# EAGLE design numitron-driver-v001 (EAGLE 9.2.1)
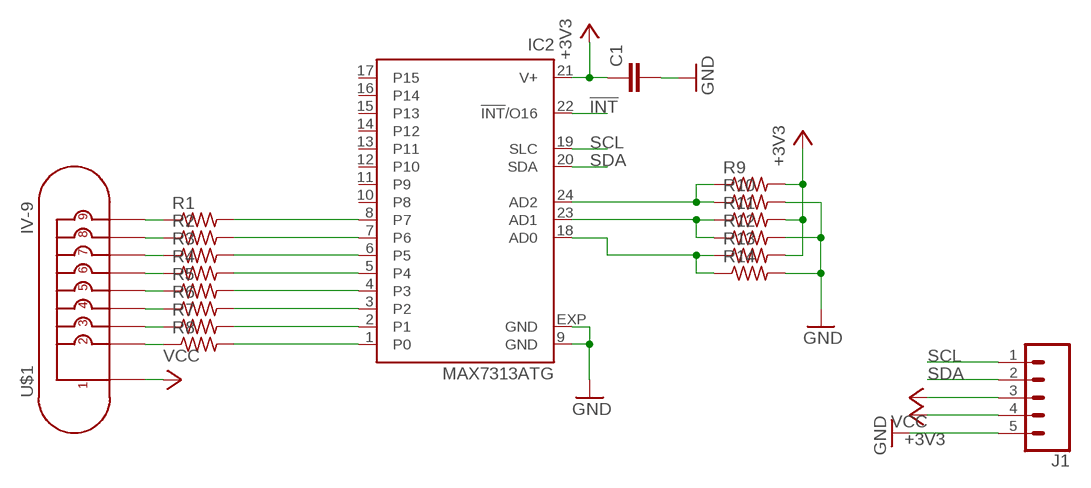
[diagram p0: schematic, sheet 1]

## Parts
C1  C-EUC0603  [C0603]
IC2  MAX7313ATG  [TQFN24-EP]
J1  CONN_05NO_SILK  [1X05_NO_SILK]
R1  R-US_R0603  [R0603]
R2  R-US_R0603  [R0603]
R3  R-US_R0603  [R0603]
R4  R-US_R0603  [R0603]
R5  R-US_R0603  [R0603]
R6  R-US_R0603  [R0603]
R7  R-US_R0603  [R0603]
R8  R-US_R0603  [R0603]
R9  R-US_R0402  [R0402]
R10  R-US_R0402  [R0402]
R11  R-US_R0402  [R0402]
R12  R-US_R0402  [R0402]
R13  R-US_R0402  [R0402]
R14  R-US_R0402  [R0402]
U$1  IV-9  [IV-9]

## Nets
!INT: IC2.22(!INT!/O16)
+3V3: C1.1 IC2.21(V+) J1.4 R9.2 R11.2 R13.2
GND: C1.2 IC2.9(GND) IC2.EXP(GND) J1.5 R10.2 R12.2 R14.2
N$1: R1.1 U$1.9
N$2: R2.1 U$1.8
N$3: R3.1 U$1.7
N$4: R4.1 U$1.6
N$5: R5.1 U$1.5
N$6: R6.1 U$1.4
N$7: R7.1 U$1.3
N$8: R8.1 U$1.2
N$9: IC2.1(P0) R8.2
N$10: IC2.2(P1) R7.2
N$11: IC2.3(P2) R6.2
N$12: IC2.4(P3) R5.2
N$13: IC2.5(P4) R4.2
N$14: IC2.6(P5) R3.2
N$15: IC2.7(P6) R2.2
N$16: IC2.8(P7) R1.2
N$24: IC2.18(AD0) R13.1 R14.1
N$25: IC2.23(AD1) R11.1 R12.1
N$26: IC2.24(AD2) R9.1 R10.1
SCL: IC2.19(SLC) J1.1
SDA: IC2.20(SDA) J1.2
VCC: J1.3 U$1.1
Unconnected: IC2.10(P8) IC2.11(P9) IC2.12(P10) IC2.13(P11) IC2.14(P12) IC2.15(P13) IC2.16(P14) IC2.17(P15)

## Library data of the parts
C1 = rcl:C-EU: CAPACITOR, European symbol; SPICEPREFIX: C
IC2 = maxim:MAX7313ATG: 16-Port I/O Expander with LED Intensity Control, Interrupt, and Hot-Insertion Protection Source: http://datasheets.maxim-ic.com/en/ds/MAX7313.pdf; MF: MAXIM; MPN: MAX7313ATG; OC_FARNELL: unknown; OC_NEWARK: 87H1899
J1 = SparkFun-Connectors:CONN_05: Multi connection point. Often used as Generic Header-pin footprint for 0.1 inch spaced/style header connections On any of the 0.1 inch spaced packages, you can populate with these: Break Away Headers - Straight <https://www.sparkfun.com/products/116> (PRT-00116) Break Away Male Headers - Right Angle <https://www.sparkfun.com/products/553> (PRT-00553) Female Headers <https://www.sparkfun.com/products/115> (PRT-00115) Break Away Headers - Machine Pin <https://www.sparkfun.com/products/117> (PRT-00117) Break Away Female Headers - Swiss Machine Pin <https://www.sparkfun.com/products/743> (PRT-00743) For SCREWTERMINALS and SPRING TERMINALS visit here: Screw Terimnals on SparkFun.com <https://www.sparkfun.com/search/results?term=Screw+Terminals> (5mm/3.5mm/2.54mm spacing) This device is also useful as a general connection point to wire up your design to another part of your project. Our various solder wires solder well into these plated through hole pads. Hook-Up Wire - Assortment (Stranded, 22 AWG) <https://www.sparkfun.com/products/11375> (PRT-11375) Hook-Up Wire - Assortment (Solid Core, 22 AWG) <https://www.sparkfun.com/products/11367> (PRT-11367) View the entire wire category on our website here <https://www.sparkfun.com/categories/141> Special notes: Molex polarized connector foot print use with SKU : PRT-08231 with associated crimp pins and housings. 1MM SMD Version SKU: PRT-10208
R1-R14 = adafruit:R-US_: RESISTOR, American symbol
U$1 = domestichacks:IV-9

## Board
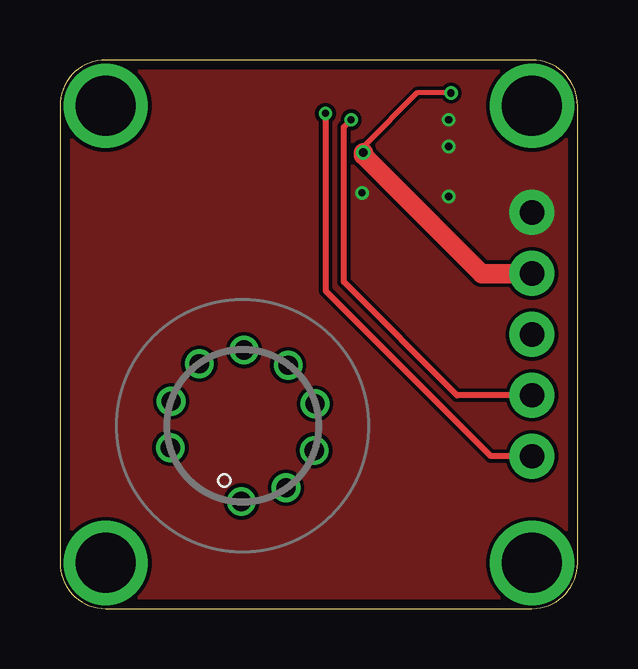
[diagram p1: board, top side]
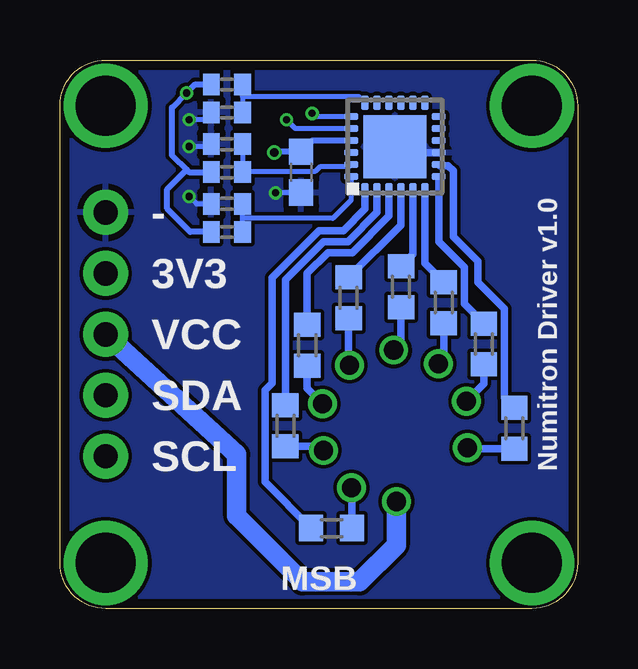
[diagram p2: board, bottom side, seen from below]

Size 21.59 x 22.86 mm. Coordinates in mm from the lower left corner, seen from the top.
Outline: 1.91,0 19.68,0 arc90 21.59,1.91 21.59,20.95 arc90 19.68,22.86 1.91,22.86 arc90 0,20.95 0,1.91 arc90 1.91,0
Copper layers (1*16): Top 0.035559375mm / dielectric 1.6mm / Bottom 0.035559375mm
Design rules "oshpark-2layer *": minimum track width 6mil, minimum drill 10mil, track to track 6mil, track to pad 6mil, pad to pad 6mil, via to via 6mil, smd to smd 6mil, copper to edge 15mil, drill to drill 6mil, minimum pad ring 5mil, minimum via ring 5mil, stop-mask expansion 2.5mil, vias tented up to drill 20mil, thermal gap 10mil

### Footprints (pad centres in the part's own frame; a part is rotated, then mirrored left to right if it is on the bottom)
C0603 = smd 1.1 x 1: 1 -0.85,0; 2 0.85,0
TQFN24-EP = smd 0.6 x 0.3: 1 -1.825,1.25; 2 -1.825,0.75; 3 -1.825,0.25; 4 -1.825,-0.25; 5 -1.825,-0.75; 6 -1.825,-1.25; 13 1.825,-1.25; 14 1.825,-0.75; 15 1.825,-0.25; 16 1.825,0.25; 17 1.825,0.75; 18 1.825,1.25 | smd 0.3 x 0.6: 7 -1.25,-1.825; 8 -0.75,-1.825; 9 -0.25,-1.825; 10 0.25,-1.825; 11 0.75,-1.825; 12 1.25,-1.825; 19 1.25,1.825; 20 0.75,1.825; 21 0.25,1.825; 22 -0.25,1.825; 23 -0.75,1.825; 24 -1.25,1.825 | smd 2.63 x 2.63: EXP 0,0
1X05_NO_SILK = drill 1.016 pad 1.88: 1 0,0; 2 2.54,0; 3 5.08,0; 4 7.62,0; 5 10.16,0
R0603 = smd 1 x 1.1: 1 -0.85,0; 2 0.85,0
R0402 = smd 0.7 x 0.9: 1 -0.65,0; 2 0.65,0
IV-9 = drill 0.8: 1 1.854,-2.552; 2 3,-0.975; 3 3,0.975; 4 1.854,2.552; 5 0,3.154; 6 -1.854,2.552; 7 -3,0.975; 8 -3,-0.975; 9 -1.854,-2.552

### Placement (x,y rotation side)
C1  11.53,18.19 270 bottom
IC2  7.62,19.25 90 bottom
J1  19.68,6.35 90 top
R1  2.64,7.52 90 bottom
R2  3.91,11.02 90 bottom
R3  5.59,12.75 90 bottom
R4  7.37,13.41 90 bottom
R5  9.55,12.95 90 bottom
R6  11.28,10.97 90 bottom
R7  12.19,7.62 90 bottom
R8  10.26,3.35 180 bottom
R9  14.63,15.7 180 bottom
R10  14.63,16.87 180 bottom
R11  14.63,18.19 180 bottom
R12  14.63,19.35 180 bottom
R13  14.63,21.84 180 bottom
R14  14.63,20.68 180 bottom
U$1  7.62,7.62 323 top

### Tracks (layer width: path | path; a pad name or v marks a point on that pad's centre or on a via)
+3V3  (via drill 0.3, 0.35)
  Top 0.203: v12.65,19 12.65,19.25 14.88,21.49 v16.31,21.49
  Top 0.813: J1.4 17.59,13.96 12.65,18.9 v12.65,19
  Bottom 0.203: 11.45,19.12 C1.1 | 16.2,18.19 16.26,18.24 16.31,18.29 16.92,18.9 | 12.61,19.04 v12.65,19
  Bottom 0.254: R9.2 16.15,15.7 17.12,16.66 17.12,17.48 16.31,18.29 | 16.2,18.19 R11.2 | 16.26,18.24 16.92,18.9 16.92,20.88 v16.31,21.49 15.95,21.84 R13.2 | IC2.21 11.06,19.5 11.45,19.12 | C1.1 12.61,19.04
GND  (via drill 0.3)
  Bottom 0.203: R14.2 15.59,20.37 v16.2,20.37 | R12.2 15.38,19.25 v16.2,19.25 | v16.2,17.17 15.9,16.87 R10.2 | C1.2 11.65,17.34 11.66,17.36 11.7,17.32 v12.6,17.32
  Bottom 0.305: IC2.9 7.37,19 IC2.EXP
  pour Top (no thermals): 0,0 21.59,0 21.59,22.86 0,22.86
  pour Bottom: 0,0 21.59,0 21.59,22.86 0,22.86
N$1
  Bottom 0.305: R1.1 4.57,6.67 U$1.9
N$2
  Bottom 0.305: R2.1 3.91,9.37 U$1.8
N$3
  Bottom 0.305: R3.1 5.59,10.43 U$1.7
N$4
  Bottom 0.305: R4.1 7.37,11.08 U$1.6
N$5
  Bottom 0.305: R5.1 9.55,10.17 U$1.5
N$6
  Bottom 0.305: R6.1 11.28,9.18 U$1.4
N$7
  Bottom 0.305: R7.1 10.78,6.77 U$1.3
N$8
  Bottom 0.305: R8.1 9.41,5.02 U$1.2
N$9
  Bottom 0.305: IC2.1 8.87,16.66 9.78,15.75 10.79,15.75 12.75,13.79 12.75,9.39 13.05,9.1 13.05,5.29 R8.2
N$10
  Bottom 0.305: IC2.2 8.37,16.51 9.59,15.29 10.6,15.29 12.19,13.7 R7.2
N$11
  Bottom 0.305: IC2.3 7.87,16.36 9.4,14.83 10.41,14.83 11.28,13.97 R6.2
N$12
  Bottom 0.305: IC2.4 7.37,15.98 R5.2
N$13
  Bottom 0.305: IC2.5 6.87,14.76 R4.2
N$14
  Bottom 0.305: IC2.6 6.37,14.38 R3.2
N$15
  Bottom 0.305: R2.2 4.73,12.7 4.73,14.23 5.79,15.29 IC2.7
N$16
  Bottom 0.305: R1.2 3.06,8.78 3.06,12.5 4.17,13.61 4.17,14.48 5.19,15.5 5.19,18.24 5.42,18.46 5.75,18.46 IC2.8
N$17  (via drill 2.5)
  other vias: 1.91,1.91
N$18  (via drill 2.5)
  other vias: 1.91,20.95
N$19  (via drill 2.5)
  other vias: 19.68,20.95
N$20  (via drill 2.5)
  other vias: 19.68,1.91
N$24
  Bottom 0.203: R13.1 13.98,21.34 | 13.98,21.34 R14.1 | IC2.18 9.13,21.34 13.98,21.34
N$25
  Bottom 0.203: R12.1 R11.1 13.93,18.23 10.93,18.23 10.75,18.41 9.54,18.41 IC2.23
N$26
  Bottom 0.203: R9.1 13.98,16.26 | 13.98,16.26 R10.1 | IC2.24 9.45,17.02 10.21,16.26 13.98,16.26
SCL  (via drill 0.3)
  Top 0.254: v11.07,20.64 11.07,13.24 17.96,6.36 J1.1
  Bottom 0.203: IC2.19 10.94,20.5 v11.07,20.64
SDA  (via drill 0.3)
  Top 0.254: v12.14,20.37 11.84,20.07 11.84,13.61 16.56,8.89 J1.2
  Bottom 0.203: IC2.20 11.77,20 v12.14,20.37
VCC
  Bottom 0.813: U$1.1 7.57,2.65 9.09,1.12 11.48,1.12 14.22,3.86 14.22,6.43 J1.3

### Text on the board
bPlace: - | 3V3 | Numitron Driver v1.0 | VCC | SDA | SCL | MSB